# Altium schematic sheet Main_Board.SchDoc: Nitrous Controller - Control unit
size A; DrawnBy: Stephane Gilbert; DocumentNumber: Git d8883a6a4
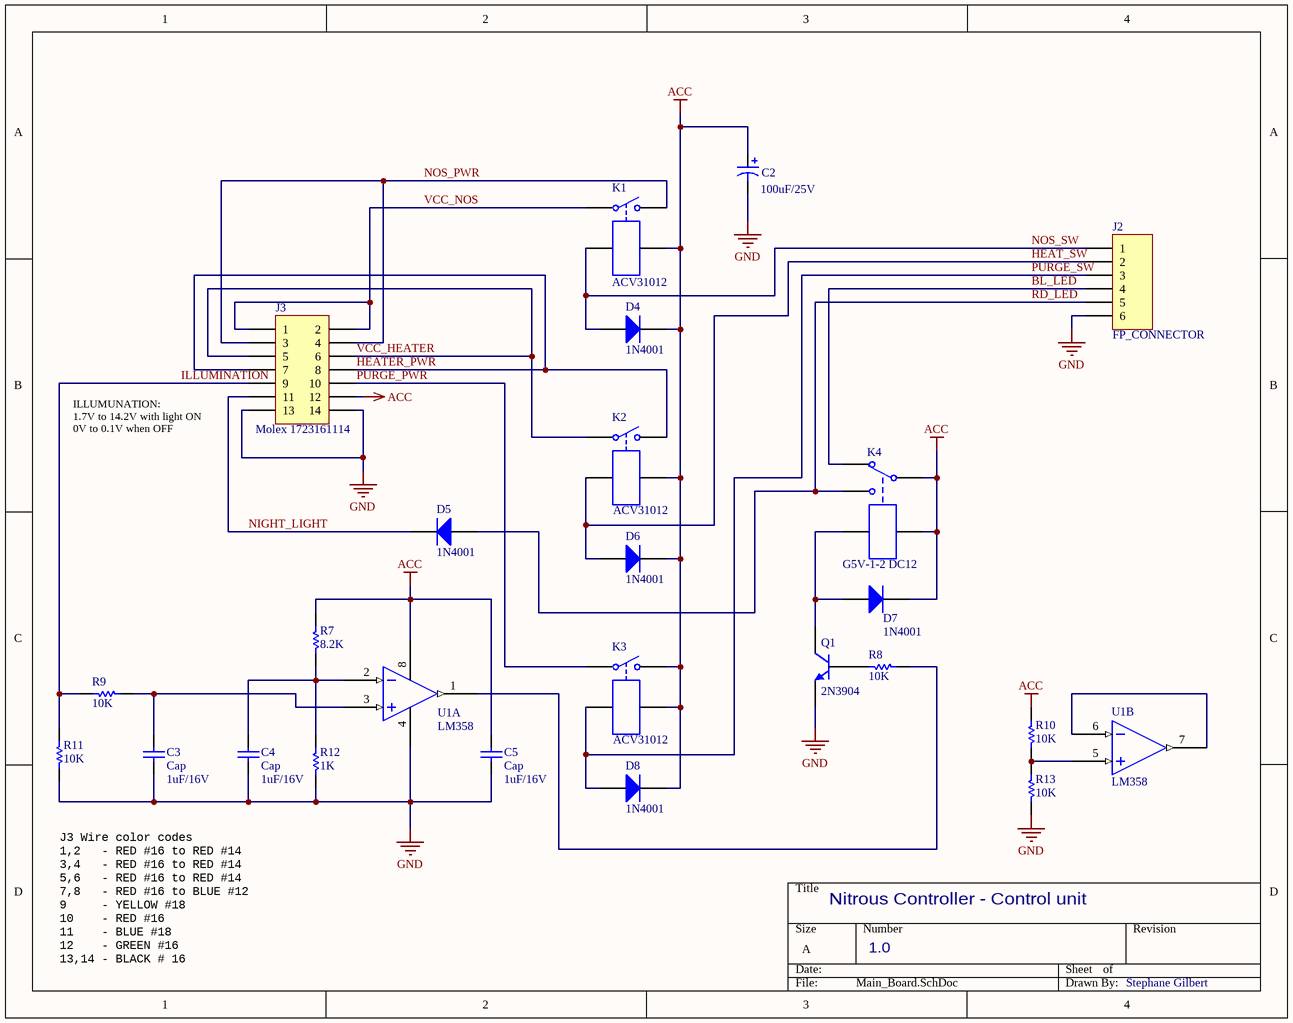
[diagram p0: Main_Board.SchDoc]

## Parts
C2  value 100uF/25V  [RB_3.5MM]  (hidden comment: Cap Pol1)
C3  Cap  value 1uF/16V  [RAD-0.2]
C4  Cap  value 1uF/16V  [RAD-0.2]
C5  Cap  value 1uF/16V  [RAD-0.2]
D4  1N4001  [DO-41]
D5  1N4001  [DO-41]
D6  1N4001  [DO-41]
D7  1N4001  [DO-41]
D8  1N4001  [DO-41]
J2  FP_CONNECTOR  [MOLEX_5329_6POS_RA]
J3  Molex 1723161114  [MOLEX_ULTRA_FIT_14_POS_RA]
K1  ACV31012  [RL_MICRO_ISO_ACV]
K2  ACV31012  [RL_MICRO_ISO_ACV]
K3  ACV31012  [RL_MICRO_ISO_ACV]
K4  G5V-1-2 DC12  [RL_G5V-1]
Q1  2N3904  [TO-92]
R7  value 8.2K  [AXIAL-0.4]  (hidden comment: Res1)
R8  value 10K  [AXIAL-0.4]  (hidden comment: Res1)
R9  value 10K  [AXIAL-0.4]  (hidden comment: Res1)
R10  value 10K  [AXIAL-0.4]  (hidden comment: Res1)
R11  value 10K  [AXIAL-0.4]  (hidden comment: Res1)
R12  value 1K  [AXIAL-0.4]  (hidden comment: Res1)
R13  value 10K  [AXIAL-0.4]  (hidden comment: Res1)
U1  LM358  [DIP-8]  (parts A,B of 2)

## Nets
ACC: C2.1 C5.2 D4.2(K) D6.2(K) D7.2(K) D8.2(K) J3.12 K1.4 K2.4 K3.2 K3.4 K4.1 K4.4 R7.1 R10.1 U1.8
GND: C2.2 C3.1 C4.1 C5.1 J2.6 J3.13 J3.14 Q1.3(E) R11.1 R12.2 R13.1 U1.4
BL_LED: J2.4 K4.2
HEAT_SW: D6.1(A) J2.2 K2.3
HEATER_PWR: J3.7 J3.8 K2.2
ILLUMINATION: J3.9 R9.2 R11.2
NIGHT_LIGHT: D5.2(K) J3.11
NOS_PWR: J3.3 J3.4 K1.2
NOS_SW: D4.1(A) J2.1 K1.3
PURGE_PWR: J3.10 K3.1
PURGE_SW: D8.1(A) J2.3 K3.3
RD_LED: D5.1(A) J2.5 K4.3
VCC_HEATER: J3.5 J3.6 K2.1
VCC_NOS: J3.1 J3.2 K1.1
NetC3_2: C3.2 R9.1 U1.3
NetC4_2: C4.2 R7.2 R12.1 U1.2
NetD7_1: D7.1(A) K4.5 Q1.1(C)
NetQ1_2: Q1.2(B) R8.2
NetR8_1: R8.1 U1.1
NetR10_2: R10.2 R13.2 U1.5
NetU1_6: U1.6 U1.7

## Notes on the sheet
- ILLUMUNATION:
  1.7V to 14.2V with light ON
  0V to 0.1V when OFF
- J3 Wire color codes
  1,2   - RED #16 to RED #14
  3,4   - RED #16 to RED #14
  5,6   - RED #16 to RED #14
  7,8   - RED #16 to BLUE #12
  9     - YELLOW #18
  10    - RED #16
  11    - BLUE #18
  12    - GREEN #16
  13,14 - BLACK # 16
- 1.0

## Library data of the parts
C2 = Cap Pol1: UBW1E101MPD1TD; Published: 8-Jun-2000; LatestRevisionDate: 17-Jul-2002; LatestRevisionNote: Re-released for DXP Platform.; PackageReference: RB7.6-15; Publisher: Altium Limited; PackageDescription: Polarized Capacitor (Radial); 2 Leads
C3-C5 = Cap: FA26X8R1E105KNU06; Published: 8-Jun-2000; LatestRevisionDate: 17-Jul-2002; LatestRevisionNote: Re-released for DXP Platform.; PackageReference: RAD-0.3; Publisher: Altium Limited; PackageDescription: Radial Cap, Thru-Hole; 2 Leads; 0.3 in Pin Spacing
D4-D8 = Diode 1N4001: 1 Amp General Purpose Rectifier; Published: 8-Jun-2000; LatestRevisionDate: 17-Jul-2002; LatestRevisionNote: Re-released for DXP Platform.; DatasheetVersion: 1998; PackageVersion: Aug-1999; PackageReference: DO-41; Publisher: Altium Limited; PackageDescription: Diode, Axial; Body 5.2 x 2.7 mm (LxDia. max), Lead Dia. 0.86 mm (max); Code_JEDEC: DO-204-AL; ComponentLink1Description: Manufacturer Link; ComponentLink1URL: http://www.fairchildsemi.com/; ComponentLink2Description: Datasheet; ComponentLink2URL: http://www.fairchildsemi.com/ds/1N%2F1N4001.pdf
J2 = Header 6: Header, 6-Pin; LatestRevisionDate: 17-Jul-2002; LatestRevisionNote: Re-released for DXP Platform.; Publisher: Altium Limited
J3 = Header 7X2: Header, 7-Pin, Dual row; LatestRevisionDate: 17-Jul-2002; LatestRevisionNote: Re-released for DXP Platform.; Publisher: Altium Limited
K1-K3 = Relay-SPST: Single-Pole Single-Throw Relay; pin to pad: 1>3 2>5 3>1 4>2; Published: 24-Mar-1999; LatestRevisionDate: 17-Jul-2002; LatestRevisionNote: Re-released for DXP Platform.; PackageReference: MODULE4; Publisher: Altium Limited
K4 = Relay-SPDT: Single-Pole Dual-Throw Relay; pin to pad: 1>5 2>1 3>10 4>9 5>2; Published: 24-Mar-1999; LatestRevisionDate: 17-Jul-2002; LatestRevisionNote: Re-released for DXP Platform.; PackageReference: MODULE5B; Publisher: Altium Limited
Q1 = NPN: NPN Bipolar Transistor; Published: 8-Jun-2000; LatestRevisionDate: 17-Jul-2002; LatestRevisionNote: Re-released for DXP Platform.; PackageReference: TO-226-AA; Publisher: Altium Limited; PackageDescription: TO, Flat Index; 3 In-Line, Axial Leads; Body Dia. 4.8mm; Leads 0.55 x 0.51 mm (max); Code_JEDEC: TO-226-AA
R7-R13 = Res1: Resistor; Published: 8-Jun-2000; LatestRevisionDate: 17-Jul-2002; LatestRevisionNote: Re-released for DXP Platform.; PackageReference: AXIAL-0.3; Publisher: Altium Limited; PackageDescription: Axial Device, Thru-Hole; 2 Leads; 0.3 in Pin Spacing